# EAGLE design Enclosure 100x68 PBIL (EAGLE 9.6.1)
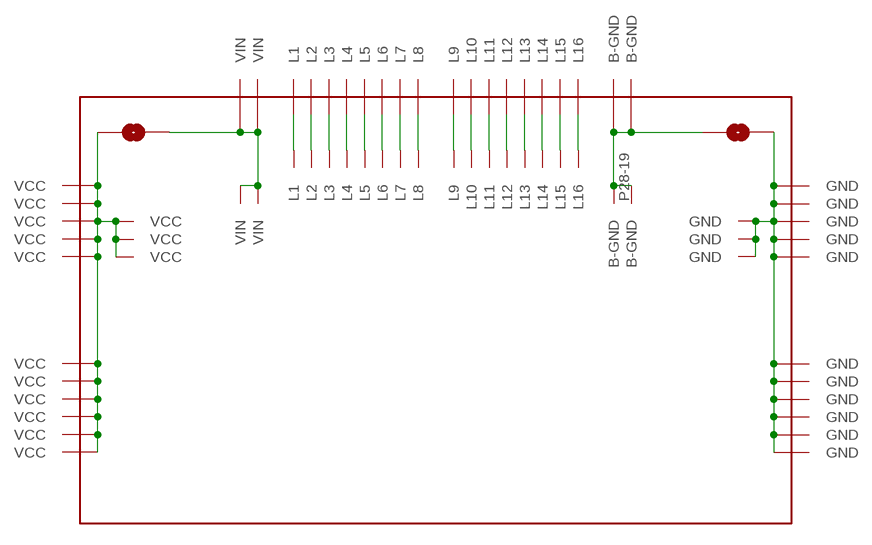
[diagram p0: schematic, sheet 1]

## Parts
P1  PROTO-34X22-BAT  [PROTO-34X22-BAT-SJ]

## Nets
GND: P1.GND P1.P33-13(GND) P1.P33-14(GND) P1.P33-15(GND) P1.P34-05(GND) P1.P34-06(GND) P1.P34-07(GND) P1.P34-08(GND) P1.P34-09(GND) P1.P34-10(GND) P1.P34-13(GND) P1.P34-14(GND) P1.P34-15(GND) P1.P34-16(GND) P1.P34-17(GND)
N$2: P1.P02-17(VIN) P1.P03-16(VIN) P1.P05-19(VIN) P1.P06-19(VIN) P1.VIN
N$3: P1.B-GND P1.P28-19(B-GND) P1.P30-19(B-GND) P1.P32-16(B-GND) P1.P33-17(B-GND)
N$6: P1.P10-21(L1) P1.P10-22(L1)
N$7: P1.P11-21(L2) P1.P11-22(L2)
N$8: P1.P12-21(L3) P1.P12-22(L3)
N$9: P1.P13-21(L4) P1.P13-22(L4)
N$10: P1.P14-21(L5) P1.P14-22(L5)
N$11: P1.P15-21(L6) P1.P15-22(L6)
N$12: P1.P16-21(L7) P1.P16-22(L7)
N$13: P1.P17-21(L8) P1.P17-22(L8)
N$14: P1.P18-21(L9) P1.P18-22(L9)
N$15: P1.P19-21(L10) P1.P19-22(L10)
N$16: P1.P20-21(L11) P1.P20-22(L11)
N$17: P1.P21-21(L12) P1.P21-22(L12)
N$18: P1.P22-21(L13) P1.P22-22(L13)
N$19: P1.P23-21(L14) P1.P23-22(L14)
N$20: P1.P24-21(L15) P1.P24-22(L15)
N$21: P1.P25-21(L16) P1.P25-22(L16)
VCC: P1.P01-05(VCC) P1.P01-06(VCC) P1.P01-07(VCC) P1.P01-08(VCC) P1.P01-09(VCC) P1.P01-10(VCC) P1.P01-13(VCC) P1.P01-14(VCC) P1.P01-15(VCC) P1.P01-16(VCC) P1.P01-17(VCC) P1.P02-13(VCC) P1.P02-14(VCC) P1.P02-15(VCC) P1.VCC

## Library data of the parts
P1 = digitalconcepts:PROTO-34X22-BAT: 34 x 22 Prototyping board, with battery connection (GND + Vcc plane) and coupled side connections to fit a 100 x 68 enclosure

## Board
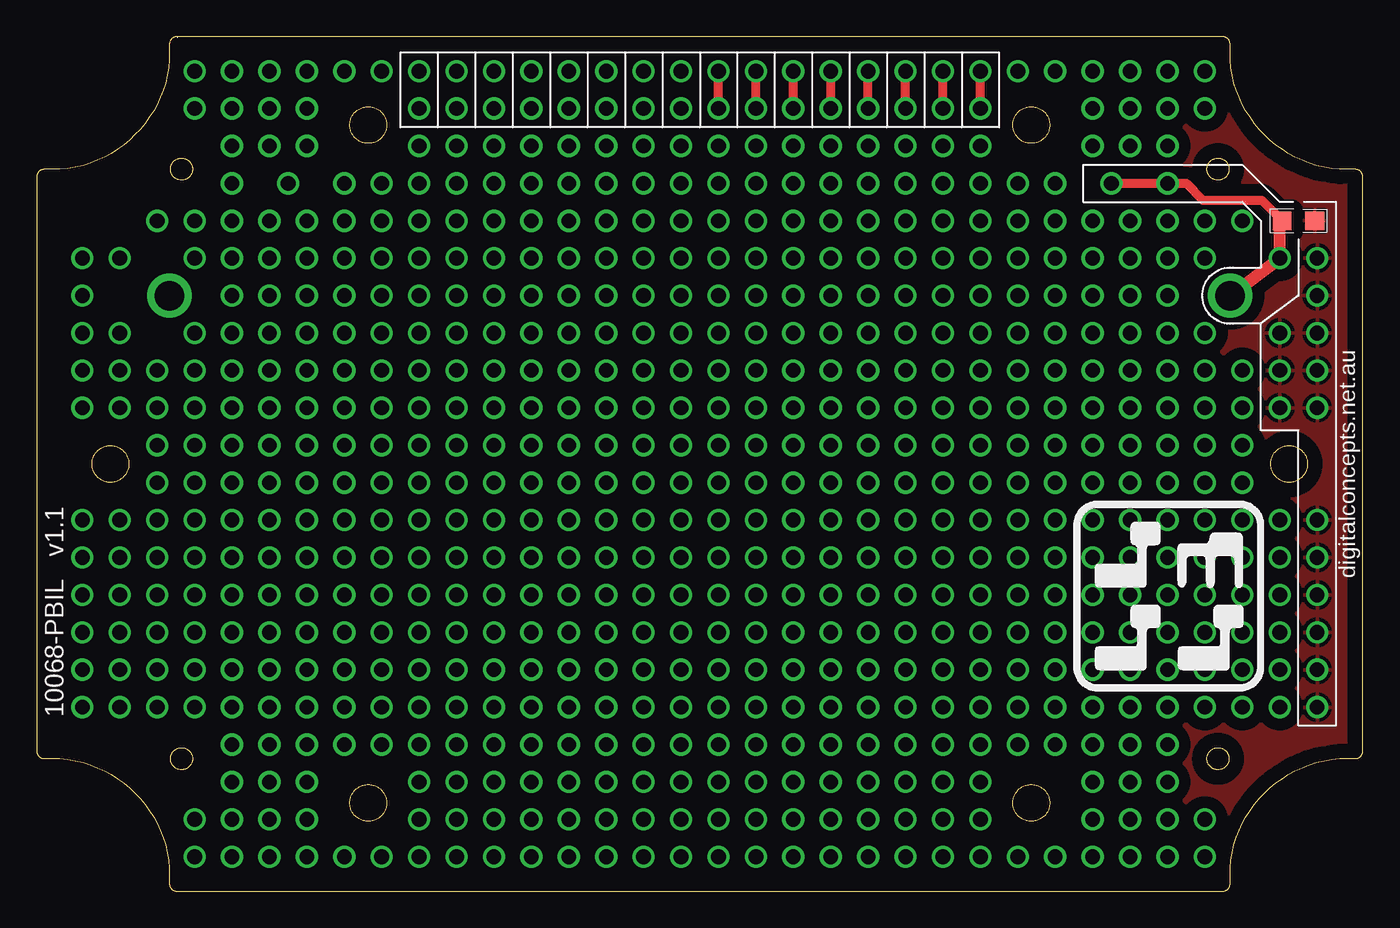
[diagram p1: board, top side]
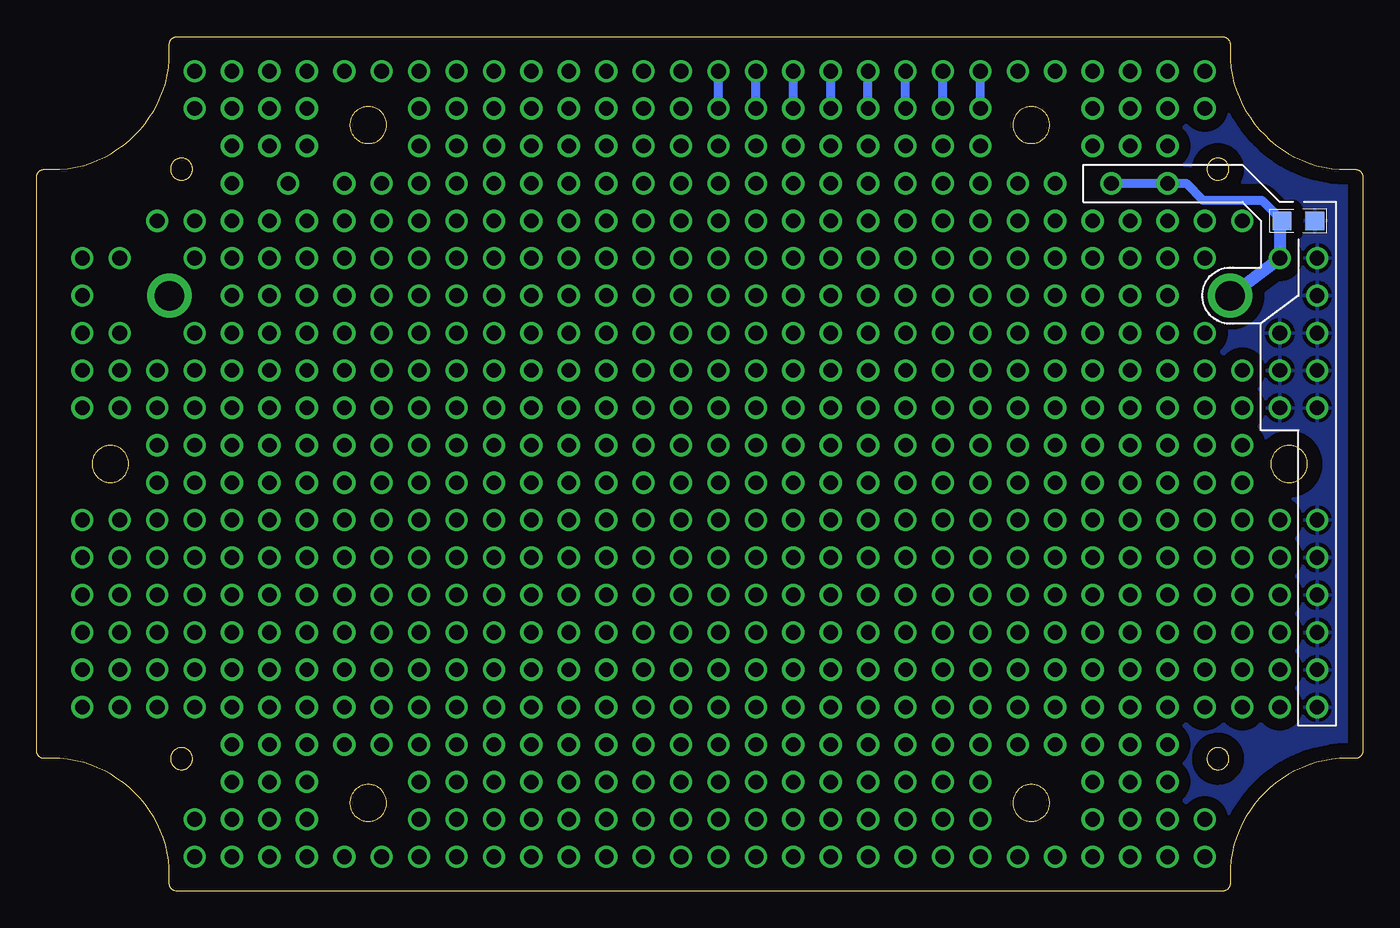
[diagram p2: board, bottom side, seen from below]

Size 90 x 58 mm. Coordinates in mm from the lower left corner, seen from the top.
Outline: 9.4,57.99 9.37,57.98 9.34,57.97 9.31,57.96 9.28,57.95 9.25,57.93 9.22,57.91 9.19,57.9 9.17,57.88 9.15,57.85 9.12,57.83 9.1,57.81 9.09,57.78 9.07,57.75 9.05,57.72 9.03,57.66 9.02,57.63 9.01,57.6 9,57.57 9,57.53 9,56.45 8.94,55.91 8.84,55.39 8.73,54.87 8.57,54.36 8.37,53.89 8.17,53.41 7.92,52.95 7.63,52.53 7.35,52.1 7.02,51.7 6.66,51.34 6.29,50.98 5.9,50.65 5.47,50.37 5.05,50.08 4.59,49.83 4.11,49.63 3.64,49.43 3.13,49.27 2.61,49.16 2.09,49.06 1.55,49 0.46,49 0.43,49 0.4,48.99 0.37,48.98 0.33,48.97 0.3,48.96 0.27,48.95 0.25,48.93 0.22,48.91 0.19,48.9 0.17,48.88 0.15,48.85 0.12,48.83 0.1,48.81 0.08,48.78 0.07,48.75 0.05,48.72 0.04,48.69 0.03,48.66 0.02,48.63 0.01,48.6 0,48.57 0,48.53 0,9.46 0,9.43 0.01,9.4 0.02,9.37 0.03,9.33 0.04,9.3 0.05,9.28 0.07,9.25 0.08,9.22 0.1,9.19 0.12,9.17 0.17,9.12 0.19,9.1 0.22,9.09 0.25,9.07 0.27,9.05 0.3,9.04 0.33,9.03 0.37,9.02 0.4,9.01 0.43,9 0.46,9 1.55,9 2.09,8.94 2.61,8.84 3.13,8.73 3.64,8.57 4.11,8.37 4.59,8.17 5.05,7.92 5.47,7.63 5.9,7.35 6.29,7.02 6.66,6.66 7.02,6.29 7.35,5.9 7.63,5.47 7.92,5.05 8.17,4.59 8.37,4.11 8.57,3.64 8.73,3.13 8.84,2.61 8.94,2.09 9,1.55 9,0.46 9,0.43 9.01,0.4 9.02,0.37 9.03,0.33 9.04,0.31 9.05,0.28 9.07,0.25 9.09,0.22 9.1,0.19 9.12,0.17 9.15,0.15 9.17,0.12 9.19,0.1 9.25,0.07 9.28,0.05 9.31,0.04 9.34,0.03 9.37,0.02 9.4,0.01 9.43,0 9.47,0 80.53,0 80.57,0 80.63,0.02 80.66,0.03 80.69,0.04 80.72,0.05 80.75,0.07 80.78,0.08 80.81,0.1 80.83,0.12 80.85,0.15 80.88,0.17 80.9,0.19 80.91,0.22 80.93,0.25 80.95,0.28 80.96,0.31 80.97,0.33 80.98,0.37 80.99,0.4 81,0.43 81,0.47 81,1.55 81.06,2.09 81.16,2.61 81.27,3.13 81.43,3.64 81.63,4.11 81.83,4.59 82.08,5.05 82.37,5.47 82.65,5.9 82.98,6.3 83.34,6.66 83.7,7.02 84.1,7.35 84.53,7.63 84.95,7.92 85.41,8.17 85.89,8.37 86.36,8.57 86.87,8.73 87.39,8.84 87.91,8.94 88.45,9 89.53,9 89.57,9 89.6,9.01 89.63,9.02 89.66,9.03 89.69,9.04 89.72,9.05 89.75,9.07 89.78,9.09 89.81,9.1 89.83,9.12 89.85,9.15 89.88,9.17 89.9,9.19 89.91,9.22 89.93,9.25 89.95,9.28 89.96,9.31 89.97,9.34 89.98,9.37 89.99,9.4 90,9.43 90,9.47 90,48.53 90,48.57 89.99,48.6 89.98,48.63 89.97,48.66 89.96,48.69 89.95,48.72 89.93,48.75 89.91,48.78 89.9,48.81 89.88,48.83 89.85,48.85 89.83,48.88 89.81,48.9 89.78,48.91 89.75,48.93 89.72,48.95 89.69,48.96 89.66,48.97 89.63,48.98 89.6,48.99 89.57,49 89.53,49 88.45,49 87.91,49.06 87.39,49.16 86.87,49.27 86.36,49.43 85.89,49.63 85.41,49.83 84.95,50.08 84.53,50.37 84.1,50.65 83.7,50.98 82.98,51.7 82.65,52.1 82.37,52.53 82.08,52.95 81.83,53.41 81.63,53.89 81.43,54.36 81.27,54.87 81.16,55.39 81.06,55.91 81,56.45 81,57.53 81,57.57 80.99,57.6 80.98,57.63 80.97,57.66 80.96,57.69 80.95,57.72 80.93,57.75 80.91,57.78 80.9,57.81 80.88,57.83 80.85,57.85 80.83,57.88 80.81,57.9 80.78,57.91 80.75,57.93 80.72,57.95 80.69,57.96 80.66,57.97 80.63,57.98 80.6,57.99 80.57,58 80.53,58 9.47,58 9.43,58 9.4,57.99
Outline: 67.76,7.21 67.84,7.2 67.92,7.17 67.99,7.14 68.07,7.11 68.14,7.07 68.2,7.02 68.27,6.98 68.33,6.93 68.44,6.81 68.5,6.75 68.54,6.69 68.59,6.62 68.62,6.55 68.66,6.47 68.69,6.4 68.71,6.32 68.73,6.24 68.75,6.16 68.75,6.07 68.75,5.9 68.75,5.82 68.73,5.74 68.71,5.65 68.69,5.58 68.66,5.5 68.62,5.43 68.59,5.36 68.54,5.29 68.5,5.22 68.44,5.16 68.33,5.05 68.27,5 68.14,4.91 68.07,4.87 67.99,4.84 67.92,4.8 67.84,4.78 67.76,4.76 67.67,4.75 67.59,4.74 67.42,4.74 67.33,4.75 67.25,4.76 67.17,4.78 67.09,4.8 67.02,4.84 66.94,4.87 66.87,4.91 66.74,5 66.68,5.05 66.56,5.16 66.51,5.22 66.47,5.29 66.42,5.36 66.38,5.43 66.35,5.5 66.32,5.58 66.3,5.65 66.26,5.82 66.25,5.9 66.25,6.07 66.26,6.16 66.28,6.24 66.3,6.32 66.32,6.4 66.35,6.47 66.38,6.55 66.42,6.62 66.47,6.69 66.51,6.75 66.56,6.81 66.68,6.93 66.74,6.98 66.8,7.02 66.87,7.07 66.94,7.11 67.02,7.14 67.09,7.17 67.17,7.2 67.25,7.21 67.33,7.23 67.42,7.24 67.59,7.24 67.67,7.23 67.76,7.21
Outline: 22.75,7.21 22.83,7.2 22.91,7.17 22.98,7.14 23.06,7.11 23.13,7.07 23.19,7.02 23.26,6.98 23.32,6.93 23.38,6.87 23.44,6.81 23.49,6.75 23.53,6.69 23.58,6.62 23.61,6.55 23.65,6.47 23.68,6.4 23.7,6.32 23.72,6.24 23.74,6.16 23.75,6.07 23.75,5.9 23.74,5.82 23.72,5.74 23.7,5.65 23.68,5.58 23.65,5.5 23.61,5.43 23.58,5.36 23.53,5.29 23.49,5.22 23.44,5.16 23.38,5.1 23.32,5.05 23.26,5 23.19,4.95 23.13,4.91 23.06,4.87 22.98,4.84 22.91,4.8 22.83,4.78 22.75,4.76 22.67,4.75 22.58,4.74 22.41,4.74 22.32,4.75 22.24,4.76 22.16,4.78 22.08,4.8 22.01,4.84 21.93,4.87 21.86,4.91 21.73,5 21.67,5.05 21.61,5.1 21.55,5.16 21.5,5.22 21.46,5.29 21.41,5.36 21.37,5.43 21.34,5.5 21.31,5.58 21.29,5.65 21.27,5.74 21.25,5.82 21.24,5.9 21.24,6.07 21.25,6.16 21.27,6.24 21.29,6.32 21.31,6.4 21.34,6.47 21.37,6.55 21.41,6.62 21.46,6.69 21.5,6.75 21.55,6.81 21.61,6.87 21.67,6.93 21.73,6.98 21.8,7.02 21.86,7.07 21.93,7.11 22.01,7.14 22.08,7.17 22.16,7.2 22.24,7.21 22.32,7.23 22.41,7.24 22.58,7.24 22.67,7.23 22.75,7.21
Outline: 80.33,9.72 80.38,9.71 80.43,9.69 80.47,9.68 80.52,9.66 80.56,9.63 80.6,9.61 80.64,9.58 80.67,9.55 80.71,9.51 80.74,9.48 80.77,9.44 80.8,9.4 80.83,9.36 80.85,9.32 80.87,9.28 80.89,9.23 80.9,9.18 80.91,9.14 80.92,9.09 80.93,9.04 80.93,8.93 80.92,8.88 80.91,8.83 80.9,8.78 80.89,8.74 80.87,8.69 80.85,8.65 80.83,8.61 80.8,8.57 80.77,8.53 80.74,8.49 80.71,8.45 80.67,8.42 80.64,8.39 80.6,8.36 80.56,8.34 80.52,8.31 80.47,8.29 80.43,8.27 80.38,8.26 80.33,8.25 80.28,8.24 80.23,8.23 80.13,8.23 80.08,8.24 80.03,8.25 79.98,8.26 79.93,8.27 79.89,8.29 79.84,8.31 79.8,8.34 79.76,8.36 79.72,8.39 79.68,8.42 79.65,8.45 79.61,8.49 79.58,8.53 79.56,8.57 79.53,8.61 79.51,8.65 79.49,8.69 79.47,8.74 79.45,8.78 79.44,8.83 79.43,8.88 79.43,8.93 79.43,9.04 79.43,9.09 79.44,9.14 79.45,9.18 79.47,9.23 79.51,9.32 79.53,9.36 79.56,9.4 79.58,9.44 79.61,9.48 79.65,9.51 79.68,9.55 79.72,9.58 79.8,9.63 79.84,9.66 79.89,9.68 79.93,9.69 79.98,9.71 80.03,9.72 80.08,9.73 80.13,9.73 80.23,9.73 80.28,9.73 80.33,9.72
Outline: 9.97,9.72 10.02,9.71 10.07,9.69 10.11,9.68 10.16,9.66 10.2,9.63 10.24,9.61 10.28,9.58 10.32,9.55 10.35,9.51 10.38,9.48 10.42,9.44 10.44,9.4 10.47,9.36 10.49,9.32 10.51,9.28 10.53,9.23 10.55,9.18 10.56,9.14 10.57,9.09 10.57,9.04 10.57,8.93 10.57,8.88 10.56,8.83 10.55,8.78 10.53,8.74 10.51,8.69 10.49,8.65 10.47,8.61 10.44,8.57 10.42,8.53 10.38,8.49 10.35,8.45 10.32,8.42 10.28,8.39 10.24,8.36 10.2,8.34 10.16,8.31 10.11,8.29 10.07,8.27 10.02,8.26 9.97,8.25 9.92,8.24 9.87,8.23 9.77,8.23 9.72,8.24 9.62,8.26 9.57,8.27 9.53,8.29 9.48,8.31 9.44,8.34 9.4,8.36 9.36,8.39 9.32,8.42 9.29,8.45 9.26,8.49 9.23,8.53 9.2,8.57 9.17,8.61 9.15,8.65 9.13,8.69 9.11,8.74 9.1,8.78 9.09,8.83 9.08,8.88 9.07,8.93 9.07,9.04 9.08,9.09 9.09,9.14 9.1,9.18 9.11,9.23 9.15,9.32 9.17,9.36 9.2,9.4 9.23,9.44 9.26,9.48 9.29,9.51 9.32,9.55 9.36,9.58 9.4,9.61 9.44,9.63 9.48,9.66 9.53,9.68 9.57,9.69 9.62,9.71 9.72,9.73 9.77,9.73 9.87,9.73 9.92,9.73 9.97,9.72
Outline: 85.26,30.22 85.34,30.21 85.42,30.18 85.49,30.15 85.57,30.12 85.64,30.08 85.77,29.99 85.83,29.94 85.89,29.88 85.94,29.83 86,29.76 86.04,29.7 86.09,29.63 86.12,29.56 86.16,29.49 86.19,29.41 86.21,29.33 86.23,29.25 86.25,29.17 86.25,29.09 86.25,28.91 86.25,28.83 86.23,28.75 86.21,28.67 86.19,28.59 86.16,28.51 86.12,28.44 86.09,28.37 86.04,28.3 86,28.23 85.94,28.17 85.89,28.12 85.83,28.06 85.77,28.01 85.7,27.96 85.64,27.92 85.57,27.88 85.42,27.82 85.34,27.79 85.26,27.77 85.17,27.76 85.09,27.75 84.92,27.75 84.83,27.76 84.75,27.77 84.67,27.79 84.59,27.82 84.52,27.85 84.44,27.88 84.37,27.92 84.31,27.96 84.24,28.01 84.18,28.06 84.12,28.12 84.06,28.17 84.01,28.23 83.97,28.3 83.92,28.37 83.88,28.44 83.85,28.51 83.82,28.59 83.8,28.67 83.78,28.75 83.76,28.83 83.75,28.91 83.75,29.09 83.76,29.17 83.78,29.25 83.8,29.33 83.82,29.41 83.85,29.49 83.88,29.56 83.92,29.63 83.97,29.7 84.01,29.76 84.06,29.83 84.12,29.88 84.18,29.94 84.24,29.99 84.31,30.04 84.37,30.08 84.44,30.12 84.52,30.15 84.59,30.18 84.67,30.21 84.75,30.22 84.83,30.24 84.92,30.25 85.09,30.25 85.17,30.24 85.26,30.22
Outline: 5.25,30.22 5.33,30.21 5.41,30.18 5.48,30.15 5.56,30.12 5.63,30.08 5.76,29.99 5.82,29.94 5.88,29.88 5.93,29.83 5.99,29.76 6.03,29.7 6.08,29.63 6.11,29.56 6.15,29.49 6.18,29.41 6.2,29.33 6.22,29.25 6.24,29.17 6.24,29.09 6.24,28.91 6.24,28.83 6.22,28.75 6.2,28.67 6.18,28.59 6.15,28.51 6.11,28.44 6.08,28.37 6.03,28.3 5.99,28.23 5.93,28.17 5.88,28.12 5.82,28.06 5.76,28.01 5.69,27.96 5.63,27.92 5.56,27.88 5.48,27.85 5.41,27.82 5.33,27.79 5.25,27.77 5.17,27.76 5.08,27.75 4.91,27.75 4.82,27.76 4.74,27.77 4.66,27.79 4.58,27.82 4.51,27.85 4.43,27.88 4.36,27.92 4.3,27.96 4.23,28.01 4.17,28.06 4.11,28.12 4.05,28.17 4,28.23 3.96,28.3 3.91,28.37 3.87,28.44 3.84,28.51 3.81,28.59 3.79,28.67 3.77,28.75 3.75,28.83 3.74,28.91 3.74,29.09 3.75,29.17 3.77,29.25 3.79,29.33 3.81,29.41 3.87,29.56 3.91,29.63 3.96,29.7 4,29.76 4.05,29.83 4.11,29.88 4.17,29.94 4.23,29.99 4.36,30.08 4.43,30.12 4.51,30.15 4.58,30.18 4.66,30.21 4.74,30.22 4.82,30.24 4.91,30.25 5.08,30.25 5.17,30.24 5.25,30.22
Outline: 80.33,49.75 80.38,49.74 80.43,49.72 80.47,49.71 80.52,49.69 80.56,49.66 80.6,49.64 80.64,49.61 80.67,49.58 80.74,49.51 80.77,49.47 80.8,49.43 80.83,49.39 80.85,49.35 80.87,49.31 80.89,49.26 80.9,49.21 80.91,49.17 80.92,49.12 80.93,49.07 80.93,48.96 80.92,48.91 80.91,48.86 80.9,48.81 80.89,48.77 80.87,48.72 80.85,48.68 80.83,48.64 80.8,48.6 80.77,48.56 80.74,48.52 80.67,48.45 80.64,48.42 80.6,48.39 80.56,48.37 80.52,48.34 80.47,48.32 80.43,48.3 80.38,48.29 80.33,48.28 80.28,48.27 80.23,48.26 80.13,48.26 80.08,48.27 80.03,48.28 79.98,48.29 79.93,48.3 79.89,48.32 79.84,48.34 79.8,48.37 79.72,48.42 79.68,48.45 79.65,48.48 79.61,48.52 79.58,48.56 79.56,48.6 79.53,48.64 79.51,48.68 79.47,48.77 79.45,48.81 79.44,48.86 79.43,48.91 79.43,48.96 79.43,49.07 79.43,49.12 79.44,49.17 79.45,49.21 79.47,49.26 79.49,49.31 79.51,49.35 79.53,49.39 79.56,49.43 79.58,49.47 79.61,49.51 79.65,49.54 79.68,49.58 79.72,49.61 79.8,49.66 79.84,49.69 79.89,49.71 79.93,49.72 79.98,49.74 80.03,49.75 80.08,49.76 80.13,49.76 80.23,49.76 80.28,49.76 80.33,49.75
Outline: 9.97,49.75 10.02,49.74 10.07,49.72 10.11,49.71 10.16,49.69 10.2,49.66 10.24,49.64 10.28,49.61 10.32,49.58 10.35,49.54 10.38,49.51 10.42,49.47 10.44,49.43 10.47,49.39 10.49,49.35 10.51,49.31 10.53,49.26 10.55,49.21 10.56,49.17 10.57,49.12 10.57,49.07 10.57,48.96 10.57,48.91 10.56,48.86 10.55,48.81 10.53,48.77 10.51,48.72 10.49,48.68 10.47,48.64 10.44,48.6 10.42,48.56 10.38,48.52 10.35,48.48 10.32,48.45 10.28,48.42 10.24,48.39 10.2,48.37 10.16,48.34 10.11,48.32 10.07,48.3 10.02,48.29 9.97,48.28 9.92,48.27 9.87,48.26 9.77,48.26 9.72,48.27 9.62,48.29 9.57,48.3 9.53,48.32 9.48,48.34 9.44,48.37 9.4,48.39 9.36,48.42 9.32,48.45 9.29,48.48 9.26,48.52 9.23,48.56 9.2,48.6 9.17,48.64 9.15,48.68 9.11,48.77 9.1,48.81 9.09,48.86 9.08,48.91 9.07,48.96 9.07,49.07 9.08,49.12 9.09,49.17 9.1,49.21 9.11,49.26 9.13,49.31 9.15,49.35 9.17,49.39 9.2,49.43 9.23,49.47 9.26,49.51 9.29,49.54 9.32,49.58 9.36,49.61 9.4,49.64 9.44,49.66 9.48,49.69 9.53,49.71 9.57,49.72 9.62,49.74 9.67,49.75 9.72,49.76 9.77,49.76 9.87,49.76 9.92,49.76 9.97,49.75
Outline: 22.24,50.79 22.16,50.8 22.08,50.83 22.01,50.86 21.93,50.89 21.86,50.93 21.8,50.98 21.73,51.02 21.67,51.07 21.61,51.13 21.55,51.19 21.5,51.25 21.46,51.31 21.41,51.38 21.37,51.45 21.34,51.53 21.31,51.6 21.29,51.68 21.27,51.76 21.25,51.84 21.24,51.93 21.24,52.1 21.25,52.18 21.27,52.26 21.29,52.35 21.31,52.42 21.34,52.5 21.37,52.57 21.41,52.64 21.46,52.71 21.5,52.78 21.55,52.84 21.61,52.9 21.67,52.95 21.73,53 21.8,53.05 21.86,53.09 21.93,53.13 22.08,53.2 22.16,53.22 22.24,53.24 22.32,53.25 22.41,53.26 22.58,53.26 22.67,53.25 22.75,53.24 22.83,53.22 22.91,53.2 23.06,53.13 23.13,53.09 23.19,53.05 23.26,53 23.32,52.95 23.38,52.9 23.44,52.84 23.49,52.78 23.53,52.71 23.58,52.64 23.61,52.57 23.65,52.5 23.68,52.42 23.7,52.35 23.72,52.26 23.74,52.18 23.75,52.1 23.75,51.93 23.74,51.84 23.72,51.76 23.7,51.68 23.68,51.6 23.61,51.45 23.58,51.38 23.53,51.31 23.49,51.25 23.44,51.19 23.38,51.13 23.32,51.07 23.26,51.02 23.19,50.98 23.13,50.93 23.06,50.89 22.98,50.86 22.91,50.83 22.83,50.8 22.75,50.79 22.67,50.77 22.58,50.76 22.41,50.76 22.32,50.77 22.24,50.79
Outline: 68.44,52.84 68.5,52.78 68.54,52.71 68.59,52.64 68.62,52.57 68.66,52.5 68.69,52.42 68.71,52.35 68.73,52.26 68.75,52.18 68.75,52.1 68.75,51.93 68.75,51.84 68.73,51.76 68.71,51.68 68.69,51.6 68.66,51.53 68.62,51.45 68.59,51.38 68.54,51.31 68.5,51.25 68.44,51.19 68.33,51.07 68.27,51.02 68.2,50.98 68.14,50.93 68.07,50.89 67.99,50.86 67.92,50.83 67.84,50.8 67.76,50.79 67.67,50.77 67.59,50.76 67.42,50.76 67.33,50.77 67.25,50.79 67.17,50.8 67.09,50.83 67.02,50.86 66.94,50.89 66.87,50.93 66.8,50.98 66.74,51.02 66.68,51.07 66.56,51.19 66.51,51.25 66.47,51.31 66.42,51.38 66.38,51.45 66.35,51.53 66.32,51.6 66.3,51.68 66.28,51.76 66.26,51.84 66.25,51.93 66.25,52.1 66.26,52.18 66.3,52.35 66.32,52.42 66.35,52.5 66.38,52.57 66.42,52.64 66.47,52.71 66.51,52.78 66.56,52.84 66.68,52.95 66.74,53 66.8,53.05 66.87,53.09 66.94,53.13 67.02,53.16 67.09,53.2 67.17,53.22 67.25,53.24 67.33,53.25 67.42,53.26 67.59,53.26 67.67,53.25 67.76,53.24 67.84,53.22 67.92,53.2 67.99,53.16 68.07,53.13 68.14,53.09 68.2,53.05 68.27,53 68.33,52.95 68.44,52.84
Copper layers (1*16): Top 0.035mm / dielectric 1.5mm / Bottom 0.035mm
Design rules "default": minimum track width 6mil, minimum drill 0.35mm, track to track 6mil, track to pad 6mil, pad to pad 6mil, via to via 6mil, smd to smd 6mil, copper to edge 40mil, drill to drill 6mil, minimum pad ring 10mil, minimum via ring 8mil, stop-mask expansion 4mil, vias tented up to drill 0mil, thermal gap 10mil

### Footprints (pad centres in the part's own frame; a part is rotated, then mirrored left to right if it is on the bottom)
PROTO-34X22-BAT-SJ = smd 1.27 x 1.27: B-GND 39.534,16.51; GND 41.746,16.51 | drill 1: P01-05 -41.91,-16.51; P01-06 -41.91,-13.97; P01-07 -41.91,-11.43; P01-08 -41.91,-8.89; P01-09 -41.91,-6.35; P01-10 -41.91,-3.81; P01-13 -41.91,3.81; P01-14 -41.91,6.35; P01-15 -41.91,8.89; P01-16 -41.91,11.43; P01-17 -41.91,13.97; P02-05 -39.37,-16.51; P02-10 -39.37,-3.81; P02-13 -39.37,3.81; P02-14 -39.37,6.35; P02-15 -39.37,8.89; P02-17 -39.37,13.97; P03-05 -36.83,-16.51; P03-10 -36.83,-3.81; P03-11 -36.83,-1.27; P03-12 -36.83,1.27; P03-13 -36.83,3.81; P03-14 -36.83,6.35; P03-18 -36.83,16.51; P04-01 -34.29,-26.67; P04-02 -34.29,-24.13; P04-05 -34.29,-16.51; P04-09 -34.29,-6.35; P04-10 -34.29,-3.81; P04-11 -34.29,-1.27; P04-12 -34.29,1.27; P04-13 -34.29,3.81; P04-14 -34.29,6.35; P04-15 -34.29,8.89; P04-17 -34.29,13.97; P04-18 -34.29,16.51; P04-21 -34.29,24.13; P04-22 -34.29,26.67; P05-01 -31.75,-26.67; P05-02 -31.75,-24.13; P05-03 -31.75,-21.59; P05-04 -31.75,-19.05; P05-09 -31.75,-6.35; P05-10 -31.75,-3.81; P05-11 -31.75,-1.27; P05-12 -31.75,1.27; P05-15 -31.75,8.89; P05-16 -31.75,11.43; P05-17 -31.75,13.97; P05-18 -31.75,16.51; P05-19 -31.75,19.05; P05-20 -31.75,21.59; P05-21 -31.75,24.13; P05-22 -31.75,26.67; P06-01 -29.21,-26.67; P06-02 -29.21,-24.13; P06-03 -29.21,-21.59; P06-04 -29.21,-19.05; P06-09 -29.21,-6.35; P06-10 -29.21,-3.81; P06-11 -29.21,-1.27; P06-12 -29.21,1.27; P06-18 -29.21,16.51; P06-19 -27.94,19.05; P06-20 -29.21,21.59; P06-21 -29.21,24.13; P06-22 -29.21,26.67; P07-01 -26.67,-26.67; P07-02 -26.67,-24.13; P07-03 -26.67,-21.59; P07-04 -26.67,-19.05; P07-09 -26.67,-6.35; P07-10 -26.67,-3.81; P07-11 -26.67,-1.27; P07-12 -26.67,1.27; P07-18 -26.67,16.51; P07-20 -26.67,21.59; P07-21 -26.67,24.13; P07-22 -26.67,26.67; P08-01 -24.13,-26.67; P08-04 -24.13,-19.05; P08-09 -24.13,-6.35; P08-10 -24.13,-3.81; P08-11 -24.13,-1.27; P08-12 -24.13,1.27; P08-18 -24.13,16.51; P08-19 -24.13,19.05; P08-22 -24.13,26.67; P09-01 -21.59,-26.67; P09-04 -21.59,-19.05; P09-18 -21.59,16.51; P09-19 -21.59,19.05; P09-22 -21.59,26.67; P10-01 -19.05,-26.67; P10-02 -19.05,-24.13; P10-03 -19.05,-21.59; P10-04 -19.05,-19.05; P10-18 -19.05,16.51; P10-19 -19.05,19.05; P10-20 -19.05,21.59; P10-21 -19.05,24.13; P10-22 -19.05,26.67; P11-01 -16.51,-26.67; P11-21 -16.51,24.13; P11-22 -16.51,26.67; P12-01 -13.97,-26.67; P12-21 -13.97,24.13; P12-22 -13.97,26.67; P13-01 -11.43,-26.67; P13-21 -11.43,24.13; P13-22 -11.43,26.67; P14-01 -8.89,-26.67; P14-21 -8.89,24.13; P14-22 -8.89,26.67; P15-01 -6.35,-26.67; P15-21 -6.35,24.13; P15-22 -6.35,26.67; P16-01 -3.81,-26.67; P16-21 -3.81,24.13; P16-22 -3.81,26.67; P17-01 -1.27,-26.67; P17-21 -1.27,24.13; P17-22 -1.27,26.67; P18-01 1.27,-26.67; P18-21 1.27,24.13; P18-22 1.27,26.67; P19-01 3.81,-26.67; P19-21 3.81,24.13; P19-22 3.81,26.67; P20-01 6.35,-26.67; P20-21 6.35,24.13; P20-22 6.35,26.67; P21-01 8.89,-26.67; P21-21 8.89,24.13; P21-22 8.89,26.67; P22-01 11.43,-26.67; P22-21 11.43,24.13; P22-22 11.43,26.67; P23-01 13.97,-26.67; P23-21 13.97,24.13; P23-22 13.97,26.67; P24-01 16.51,-26.67; P24-21 16.51,24.13; P24-22 16.51,26.67; P25-01 19.05,-26.67; P25-02 19.05,-24.13; P25-03 19.05,-21.59; P25-04 19.05,-19.05; P25-19 19.05,19.05; P25-20 19.05,21.59; P25-21 19.05,24.13; P25-22 19.05,26.67; P26-01 21.59,-26.67; P26-04 21.59,-19.05; P26-19 21.59,19.05; P26-22 21.59,26.67; P27-01 24.13,-26.67; P27-04 24.13,-19.05; P27-09 24.13,-6.35; P27-10 24.13,-3.81; P27-11 24.13,-1.27; P27-12 24.13,1.27; P27-18 24.13,16.51; P27-19 24.13,19.05; P27-22 24.13,26.67; P28-01 26.67,-26.67; P28-02 26.67,-24.13; P28-03 26.67,-21.59; P28-04 26.67,-19.05; P28-09 26.67,-6.35; P28-10 26.67,-3.81; P28-11 26.67,-1.27; P28-12 26.67,1.27; P28-18 26.67,16.51; P28-19 27.94,19.05; P28-20 26.67,21.59; P28-21 26.67,24.13; P28-22 26.67,26.67; P29-01 29.21,-26.67; P29-02 29.21,-24.13; P29-03 29.21,-21.59; P29-04 29.21,-19.05; P29-09 29.21,-6.35; P29-10 29.21,-3.81; P29-11 29.21,-1.27; P29-12 29.21,1.27; P29-14 29.21,6.35; P29-15 29.21,8.89; P29-16 29.21,11.43; P29-17 29.21,13.97; P29-18 29.21,16.51; P29-20 29.21,21.59; P29-21 29.21,24.13; P29-22 29.21,26.67; P30-01 31.75,-26.67; P30-02 31.75,-24.13; P30-03 31.75,-21.59; P30-04 31.75,-19.05; P30-05 31.75,-16.51; P30-09 31.75,-6.35; P30-10 31.75,-3.81; P30-11 31.75,-1.27; P30-12 31.75,1.27; P30-14 31.75,6.35; P30-15 31.75,8.89; P30-16 31.75,11.43; P30-17 31.75,13.97; P30-18 31.75,16.51; P30-19 31.75,19.05; P30-20 31.75,21.59; P30-21 31.75,24.13; P30-22 31.75,26.67; P31-01 34.29,-26.67; P31-02 34.29,-24.13; P31-05 34.29,-16.51; P31-09 34.29,-6.35; P31-10 34.29,-3.81; P31-11 34.29,-1.27; P31-12 34.29,1.27; P31-13 34.29,3.81; P31-14 34.29,6.35; P31-15 34.29,8.89; P31-17 34.29,13.97; P31-18 34.29,16.51; P31-21 34.29,24.13; P31-22 34.29,26.67; P32-05 36.83,-16.51; P32-10 36.83,-3.81; P32-11 36.83,-1.27; P32-12 36.83,1.27; P32-13 36.83,3.81; P32-14 36.83,6.35; P32-18 36.83,16.51; P33-05 39.37,-16.51; P33-10 39.37,-3.81; P33-13 39.37,3.81; P33-14 39.37,6.35; P33-15 39.37,8.89; P33-17 39.37,13.97; P34-05 41.91,-16.51; P34-06 41.91,-13.97; P34-07 41.91,-11.43; P34-08 41.91,-8.89; P34-09 41.91,-6.35; P34-10 41.91,-3.81; P34-13 41.91,3.81; P34-14 41.91,6.35; P34-15 41.91,8.89; P34-16 41.91,11.43; P34-17 41.91,13.97; P44 16.51,-24.13; P45 13.97,-24.13; P46 11.43,-24.13; P47 8.89,-24.13; P48 6.35,-24.13; P49 3.81,-24.13; P50 1.27,-24.13; P51 -1.27,-24.13; P52 -3.81,-24.13; P53 -6.35,-24.13; P54 -8.89,-24.13; P55 -11.43,-24.13; P56 -13.97,-24.13; P57 -16.51,-24.13; P78 -16.51,-21.59; P79 -13.97,-21.59; P80 -11.43,-21.59; P81 -8.89,-21.59; P82 -6.35,-21.59; P83 -3.81,-21.59; P84 -1.27,-21.59; P85 1.27,-21.59; P86 3.81,-21.59; P87 6.35,-21.59; P88 8.89,-21.59; P89 11.43,-21.59; P90 13.97,-21.59; P91 16.51,-21.59; P112 16.51,-19.05; P113 13.97,-19.05; P114 11.43,-19.05; P115 8.89,-19.05; P116 6.35,-19.05; P117 3.81,-19.05; P118 1.27,-19.05; P119 -1.27,-19.05; P120 -3.81,-19.05; P121 -6.35,-19.05; P122 -8.89,-19.05; P123 -11.43,-19.05; P124 -13.97,-19.05; P125 -16.51,-19.05; P140 -31.75,-16.51; P141 -29.21,-16.51; P142 -26.67,-16.51; P143 -24.13,-16.51; P144 -21.59,-16.51; P145 -19.05,-16.51; P146 -16.51,-16.51; P147 -13.97,-16.51; P148 -11.43,-16.51; P149 -8.89,-16.51; P150 -6.35,-16.51; P151 -3.81,-16.51; P152 -1.27,-16.51; P153 1.27,-16.51; P154 3.81,-16.51; P155 6.35,-16.51; P156 8.89,-16.51; P157 11.43,-16.51; P158 13.97,-16.51; P159 16.51,-16.51; P160 19.05,-16.51; P161 21.59,-16.51; P162 24.13,-16.51; P163 26.67,-16.51; P164 29.21,-16.51; P171 39.37,-13.97; P172 36.83,-13.97; P173 34.29,-13.97; P174 31.75,-13.97; P175 29.21,-13.97; P176 26.67,-13.97; P177 24.13,-13.97; P178 21.59,-13.97; P179 19.05,-13.97; P180 16.51,-13.97; P181 13.97,-13.97; P182 11.43,-13.97; P183 8.89,-13.97; P184 6.35,-13.97; P185 3.81,-13.97; P186 1.27,-13.97; P187 -1.27,-13.97; P188 -3.81,-13.97; P189 -6.35,-13.97; P190 -8.89,-13.97; P191 -11.43,-13.97; P192 -13.97,-13.97; P193 -16.51,-13.97; P194 -19.05,-13.97; P195 -21.59,-13.97; P196 -24.13,-13.97; P197 -26.67,-13.97; P198 -29.21,-13.97; P199 -31.75,-13.97; P200 -34.29,-13.97; P201 -36.83,-13.97; P202 -39.37,-13.97; P205 -39.37,-11.43; P206 -36.83,-11.43; P207 -34.29,-11.43; P208 -31.75,-11.43; P209 -29.21,-11.43; P210 -26.67,-11.43; P211 -24.13,-11.43; P212 -21.59,-11.43; P213 -19.05,-11.43; P214 -16.51,-11.43; P215 -13.97,-11.43; P216 -11.43,-11.43; P217 -8.89,-11.43; P218 -6.35,-11.43; P219 -3.81,-11.43; P220 -1.27,-11.43; P221 1.27,-11.43; P222 3.81,-11.43; P223 6.35,-11.43; P224 8.89,-11.43; P225 11.43,-11.43; P226 13.97,-11.43; P227 16.51,-11.43; P228 19.05,-11.43; P229 21.59,-11.43; P230 24.13,-11.43; P231 26.67,-11.43; P232 29.21,-11.43; P233 31.75,-11.43; P234 34.29,-11.43; P235 36.83,-11.43; P236 39.37,-11.43; P239 39.37,-8.89; P240 36.83,-8.89; P241 34.29,-8.89; P242 31.75,-8.89; P243 29.21,-8.89; P244 26.67,-8.89; P245 24.13,-8.89; P246 21.59,-8.89; P247 19.05,-8.89; P248 16.51,-8.89; P249 13.97,-8.89; P250 11.43,-8.89; P251 8.89,-8.89; P252 6.35,-8.89; P253 3.81,-8.89; P254 1.27,-8.89; P255 -1.27,-8.89; P256 -3.81,-8.89; P257 -6.35,-8.89; P258 -8.89,-8.89; P259 -11.43,-8.89; P260 -13.97,-8.89; P261 -16.51,-8.89; P262 -19.05,-8.89; P263 -21.59,-8.89; P264 -24.13,-8.89; P265 -26.67,-8.89; P266 -29.21,-8.89; P267 -31.75,-8.89; P268 -34.29,-8.89; P269 -36.83,-8.89; P270 -39.37,-8.89; P273 -39.37,-6.35; P274 -36.83,-6.35; P280 -21.59,-6.35; P281 -19.05,-6.35; P282 -16.51,-6.35; P283 -13.97,-6.35; P284 -11.43,-6.35; P285 -8.89,-6.35; P286 -6.35,-6.35; P287 -3.81,-6.35; P288 -1.27,-6.35; P289 1.27,-6.35; P290 3.81,-6.35; P291 6.35,-6.35; P292 8.89,-6.35; P293 11.43,-6.35; P294 13.97,-6.35; P295 16.51,-6.35; P296 19.05,-6.35; P297 21.59,-6.35; P303 36.83,-6.35; P304 39.37,-6.35; P314 21.59,-3.81; P315 19.05,-3.81; P316 16.51,-3.81; P317 13.97,-3.81; P318 11.43,-3.81; P319 8.89,-3.81; P320 6.35,-3.81; P321 3.81,-3.81; P322 1.27,-3.81; P323 -1.27,-3.81; P324 -3.81,-3.81; P325 -6.35,-3.81; P326 -8.89,-3.81; P327 -11.43,-3.81; P328 -13.97,-3.81; P329 -16.51,-3.81; P330 -19.05,-3.81; P331 -21.59,-3.81; P348 -21.59,-1.27; P349 -19.05,-1.27; P350 -16.51,-1.27; P351 -13.97,-1.27; P352 -11.43,-1.27; P353 -8.89,-1.27; P354 -6.35,-1.27; P355 -3.81,-1.27; P356 -1.27,-1.27; P357 1.27,-1.27; P358 3.81,-1.27; P359 6.35,-1.27; P360 8.89,-1.27; P361 11.43,-1.27; P362 13.97,-1.27; P363 16.51,-1.27; P364 19.05,-1.27; P365 21.59,-1.27; P382 21.59,1.27; P383 19.05,1.27; P384 16.51,1.27; P385 13.97,1.27; P386 11.43,1.27; P387 8.89,1.27; P388 6.35,1.27; P389 3.81,1.27; P390 1.27,1.27; P391 -1.27,1.27; P392 -3.81,1.27; P393 -6.35,1.27; P394 -8.89,1.27; P395 -11.43,1.27; P396 -13.97,1.27; P397 -16.51,1.27; P398 -19.05,1.27; P399 -21.59,1.27; P412 -31.75,3.81; P413 -29.21,3.81; P414 -26.67,3.81; P415 -24.13,3.81; P416 -21.59,3.81; P417 -19.05,3.81; P418 -16.51,3.81; P419 -13.97,3.81; P420 -11.43,3.81; P421 -8.89,3.81; P422 -6.35,3.81; P423 -3.81,3.81; P424 -1.27,3.81; P425 1.27,3.81; P426 3.81,3.81; P427 6.35,3.81; P428 8.89,3.81; P429 11.43,3.81; P430 13.97,3.81; P431 16.51,3.81; P432 19.05,3.81; P433 21.59,3.81; P434 24.13,3.81; P435 26.67,3.81; P436 29.21,3.81; P437 31.75,3.81; P448 26.67,6.35; P449 24.13,6.35; P450 21.59,6.35; P451 19.05,6.35; P452 16.51,6.35; P453 13.97,6.35; P454 11.43,6.35; P455 8.89,6.35; P456 6.35,6.35; P457 3.81,6.35; P458 1.27,6.35; P459 -1.27,6.35; P460 -3.81,6.35; P461 -6.35,6.35; P462 -8.89,6.35; P463 -11.43,6.35; P464 -13.97,6.35; P465 -16.51,6.35; P466 -19.05,6.35; P467 -21.59,6.35; P468 -24.13,6.35; P469 -26.67,6.35; P470 -29.21,6.35; P471 -31.75,6.35; P481 -29.21,8.89; P482 -26.67,8.89; P483 -24.13,8.89; P484 -21.59,8.89; P485 -19.05,8.89; P486 -16.51,8.89; P487 -13.97,8.89; P488 -11.43,8.89; P489 -8.89,8.89; P490 -6.35,8.89; P491 -3.81,8.89; P492 -1.27,8.89; P493 1.27,8.89; P494 3.81,8.89; P495 6.35,8.89; P496 8.89,8.89; P497 11.43,8.89; P498 13.97,8.89; P499 16.51,8.89; P500 19.05,8.89; P501 21.59,8.89; P502 24.13,8.89; P503 26.67,8.89; P516 26.67,11.43; P517 24.13,11.43; P518 21.59,11.43; P519 19.05,11.43; P520 16.51,11.43; P521 13.97,11.43; P522 11.43,11.43; P523 8.89,11.43; P524 6.35,11.43; P525 3.81,11.43; P526 1.27,11.43; P527 -1.27,11.43; P528 -3.81,11.43; P529 -6.35,11.43; P530 -8.89,11.43; P531 -11.43,11.43; P532 -13.97,11.43; P533 -16.51,11.43; P534 -19.05,11.43; P535 -21.59,11.43; P536 -24.13,11.43; P537 -26.67,11.43; P538 -29.21,11.43; P549 -29.21,13.97; P550 -26.67,13.97; P551 -24.13,13.97; P552 -21.59,13.97; P553 -19.05,13.97; P554 -16.51,13.97; P555 -13.97,13.97; P556 -11.43,13.97; P557 -8.89,13.97; P558 -6.35,13.97; P559 -3.81,13.97; P560 -1.27,13.97; P561 1.27,13.97; P562 3.81,13.97; P563 6.35,13.97; P564 8.89,13.97; P565 11.43,13.97; P566 13.97,13.97; P567 16.51,13.97; P568 19.05,13.97; P569 21.59,13.97; P570 24.13,13.97; P571 26.67,13.97; P586 21.59,16.51; P587 19.05,16.51; P588 16.51,16.51; P589 13.97,16.51; P590 11.43,16.51; P591 8.89,16.51; P592 6.35,16.51; P593 3.81,16.51; P594 1.27,16.51; P595 -1.27,16.51; P596 -3.81,16.51; P597 -6.35,16.51; P598 -8.89,16.51; P599 -11.43,16.51; P600 -13.97,16.51; P601 -16.51,16.51; P622 -16.51,19.05; P623 -13.97,19.05; P624 -11.43,19.05; P625 -8.89,19.05; P626 -6.35,19.05; P627 -3.81,19.05; P628 -1.27,19.05; P629 1.27,19.05; P630 3.81,19.05; P631 6.35,19.05; P632 8.89,19.05; P633 11.43,19.05; P634 13.97,19.05; P635 16.51,19.05; P656 16.51,21.59; P657 13.97,21.59; P658 11.43,21.59; P659 8.89,21.59; P660 6.35,21.59; P661 3.81,21.59; P662 1.27,21.59; P663 -1.27,21.59; P664 -3.81,21.59; P665 -6.35,21.59; P666 -8.89,21.59; P667 -11.43,21.59; P668 -13.97,21.59; P669 -16.51,21.59 | drill 2: P03-16 -36.005,11.43; P32-16 36.005,11.43 | smd 1.27 x 1.27 bottom: VCC -41.746,16.51; VIN -39.534,16.51

### Placement (x,y rotation side)
P1  45,29 0 top

### Tracks (layer width: path | path; a pad name or v marks a point on that pad's centre or on a via)
GND
  pour Top (isolate 0.813): -1.48,59.48 -1.48,-1.48 91.61,-1.48 91.61,59.48
N$2
  Bottom 0.406: P1.VIN 5.63,45.35
  Bottom 0.61: P1.P06-19 P1.P05-19 11.98,48.05 10.84,46.91 6.86,46.91 P1.VIN
  Bottom 0.813: P1.P03-16 P1.P02-17 5.63,45.35
N$3
  Top 0.406: 84.37,45.35 P1.B-GND
  Top 0.61: P1.P28-19 P1.P30-19 78.02,48.05 79.16,46.91 83.14,46.91 P1.B-GND
  Top 0.813: P1.P32-16 P1.P33-17 84.37,45.35
N$6
  Bottom 0.61: P1.P10-21 P1.P10-22
N$7
  Bottom 0.61: P1.P11-21 P1.P11-22
N$8
  Bottom 0.61: P1.P12-21 P1.P12-22
N$9
  Bottom 0.61: P1.P13-21 P1.P13-22
N$10
  Bottom 0.61: P1.P14-21 P1.P14-22
N$11
  Bottom 0.61: P1.P15-21 P1.P15-22
N$12
  Bottom 0.61: P1.P16-21 P1.P16-22
N$13
  Bottom 0.61: P1.P17-21 P1.P17-22
N$14
  Top 0.61: P1.P18-21 P1.P18-22
N$15
  Top 0.61: P1.P19-21 P1.P19-22
N$16
  Top 0.61: P1.P20-21 P1.P20-22
N$17
  Top 0.61: P1.P21-21 P1.P21-22
N$18
  Top 0.61: P1.P22-21 P1.P22-22
N$19
  Top 0.61: P1.P23-21 P1.P23-22
N$20
  Top 0.61: P1.P24-21 P1.P24-22
N$21
  Top 0.61: P1.P25-21 P1.P25-22
VCC
  pour Bottom (isolate 0.813): -0.21,58.21 -0.21,-0.21 90.34,-0.21 90.34,58.21

### Text on the board
tPlace: digitalconcepts.net.au | 10068-PBIL v1.1